# EAGLE design Auto Temp Sensor Second Way (EAGLE 9.6.2)
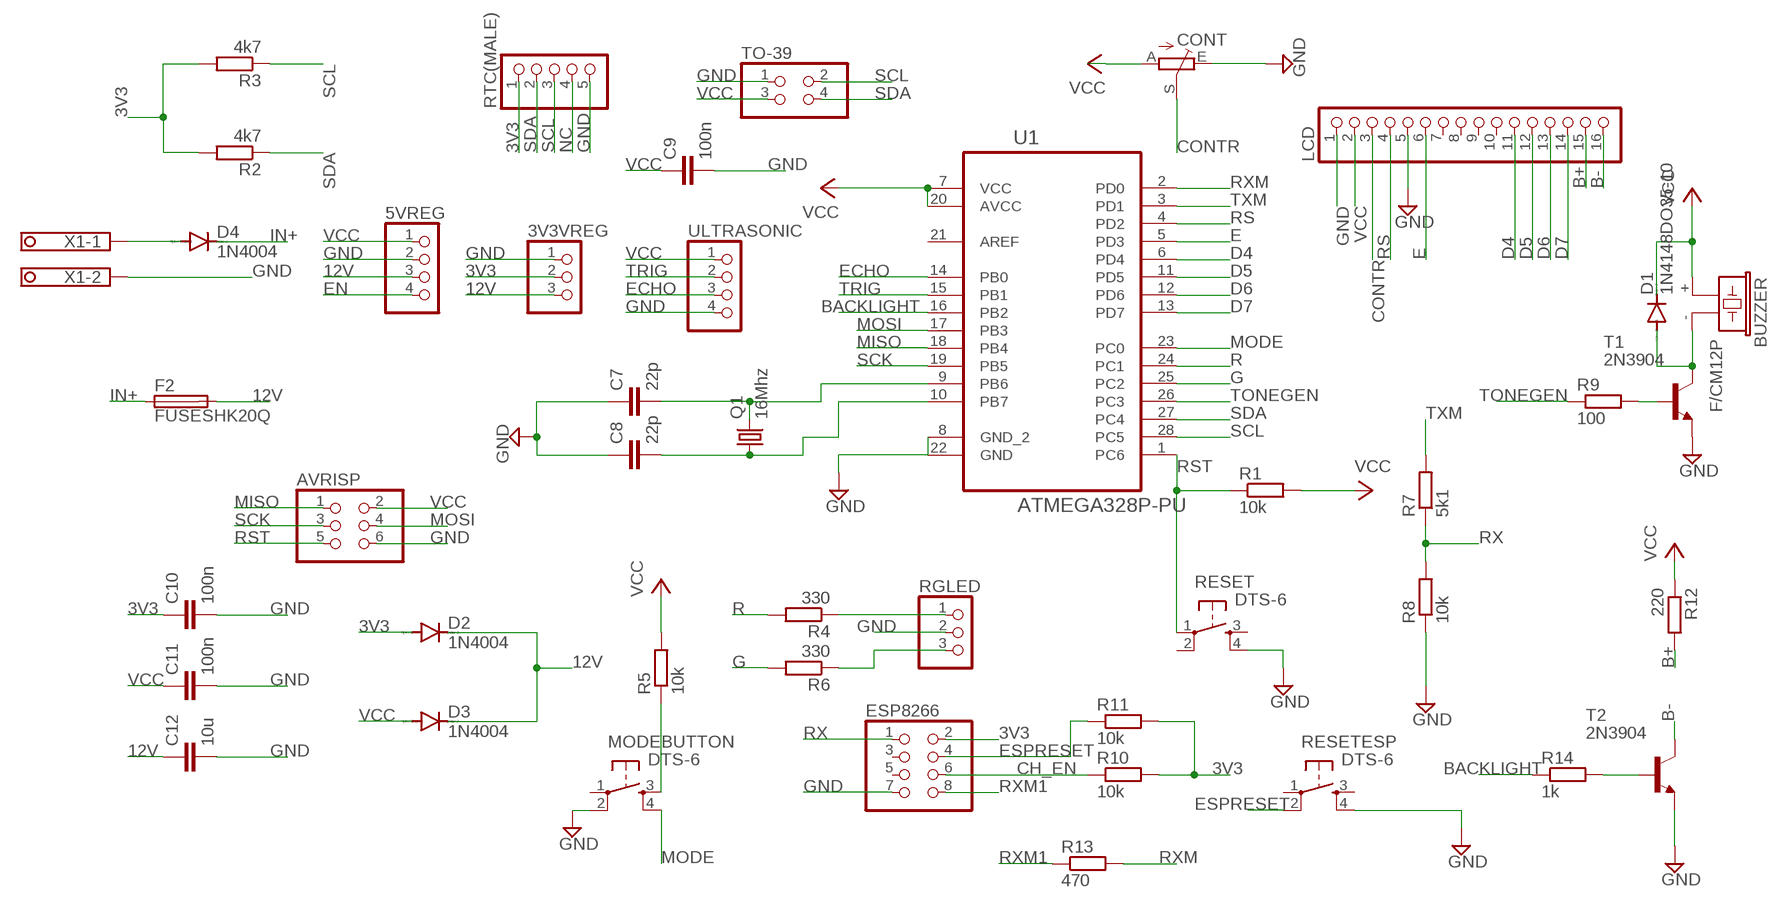
[diagram p0: schematic, sheet 1]

## Parts
3V3VREG  PINHD-1X3M  [1X03M]
5VREG  PINHD-1X4M  [1X04M]
AVRISP  PINHD-2X3  [2X03]
BUZZER  F/CM12P  [F/CM12P]
C7  22p  C-EU050-024X044  [C050-024X044]
C8  22p  C-EU050-024X044  [C050-024X044]
C9  100n  C-EU050-024X044  [C050-024X044]
C10  100n  C-EU050-024X044  [C050-024X044]
C11  100n  C-EU050-024X044  [C050-024X044]
C12  10u  C-EU050-024X044  [C050-024X044]
CONT  10k  TRIM_EU-B25P  [B25P]
D1  1N4148DO35-10  [DO35-10]
D2  1N4004  [DO41-10]
D3  1N4004  [DO41-10]
D4  1N4004  [DO41-10]
ESP8266  PINHD-2X4  [2X04]
F2  FUSESHK20Q  [SHK20Q]
LCD  PINHD-1X16  [1X16]
MODEBUTTON  DTS-6  [DTS-6]
Q1  16Mhz  CRYSTALHC49S  [HC49/S]
R1  10k  R-EU_0207/10  [0207/10]
R2  4k7  R-EU_0207/10  [0207/10]
R3  4k7  R-EU_0207/10  [0207/10]
R4  330  R-EU_0207/10  [0207/10]
R5  10k  R-EU_0207/10  [0207/10]
R6  330  R-EU_0207/10  [0207/10]
R7  5k1  R-EU_0207/10  [0207/10]
R8  10k  R-EU_0207/10  [0207/10]
R9  100  R-EU_0207/10  [0207/10]
R10  10k  R-EU_0207/10  [0207/10]
R11  10k  R-EU_0207/10  [0207/10]
R12  220  R-EU_0207/10  [0207/10]
R13  470  R-EU_0207/10  [0207/10]
R14  1k  R-EU_0207/10  [0207/10]
RESET  DTS-6  [DTS-6]
RESETESP  DTS-6  [DTS-6]
RGLED  PINHD-1X3M  [1X03M]
RTC(MALE)  PINHD-1X5  [1X05]
T1  2N3904  [TO92]
T2  2N3904  [TO92]
TO-39  PINHD-2X2  [2X02]
U1  ATMEGA328P-PU  [DIP254P762X457-28]
ULTRASONIC  PINHD-1X4  [1X04]
X1  TERMINAL-BLOCK-3.5MM-2-PIN-LONG-PAD  [TERMINAL-BLOCK-2-PIN-3.5MM-LONG-PAD]

## Nets
3V3: 3V3VREG.2 C10.1 D2.A ESP8266.2 R2.2 R3.2 R10.2 R11.2 RTC(MALE).1
12V: 3V3VREG.3 5VREG.3 C12.1 D2.C D3.C F2.2A
B+: LCD.15 R12.2
B-: LCD.16 T2.1(C)
BACKLIGHT: R14.1 U1.16(PB2)
CH_EN: ESP8266.6 R10.1
CONTR: CONT.S LCD.3
D4: LCD.11 U1.6(PD4)
D5: LCD.12 U1.11(PD5)
D6: LCD.13 U1.12(PD6)
D7: LCD.14 U1.13(PD7)
E: LCD.6 U1.5(PD3)
ECHO: U1.14(PB0) ULTRASONIC.3
EN: 5VREG.4
ESPRESET: ESP8266.4 R11.1 RESETESP.2
G: R6.2 U1.25(PC2)
GND: 3V3VREG.1 5VREG.2 AVRISP.6 C7.1 C8.1 C9.2 C10.2 C11.2 C12.2 CONT.E ESP8266.7 LCD.1 LCD.5 MODEBUTTON.2 R8.1 RESET.4 RESETESP.4 RGLED.2 RTC(MALE).5 T1.3(E) T2.3(E) TO-39.1 U1.8(GND_2) U1.22(GND) ULTRASONIC.4 X1.2
IN+: D4.C F2.1A
MISO: AVRISP.1 U1.18(PB4)
MODE: MODEBUTTON.4 U1.23(PC0)
MOSI: AVRISP.4 U1.17(PB3)
N$1: R14.2 T2.2(B)
N$2: C8.2 Q1.1 U1.10(PB7)
N$3: C7.2 Q1.2 U1.9(PB6)
N$5: D4.A X1.1
N$7: R4.1 RGLED.1
N$8: R6.1 RGLED.3
N$9: MODEBUTTON.3 R5.1
N$13: BUZZER.- D1.A T1.1(C)
N$14: R9.2 T1.2(B)
NC: RTC(MALE).4
R: R4.2 U1.24(PC1)
RS: LCD.4 U1.4(PD2)
RST: AVRISP.5 R1.1 RESET.1 U1.1(PC6)
RX: ESP8266.1 R7.1 R8.2
RXM: R13.2 U1.2(PD0)
RXM1: ESP8266.8 R13.1
SCK: AVRISP.3 U1.19(PB5)
SCL: R3.1 RTC(MALE).3 TO-39.2 U1.28(PC5)
SDA: R2.1 RTC(MALE).2 TO-39.4 U1.27(PC4)
TONEGEN: R9.1 U1.26(PC3)
TRIG: U1.15(PB1) ULTRASONIC.2
TXM: R7.2 U1.3(PD1)
VCC: 5VREG.1 AVRISP.2 BUZZER.+ C9.1 C11.1 CONT.A D1.C D3.A LCD.2 R1.2 R5.2 R12.1 TO-39.3 U1.7(VCC) U1.20(AVCC) ULTRASONIC.1
Unconnected: ESP8266.3 ESP8266.5 LCD.7 LCD.8 LCD.9 LCD.10 MODEBUTTON.1 RESET.2 RESET.3 RESETESP.1 RESETESP.3 U1.21(AREF)

## Library data of the parts
3V3VREG RGLED = pinhead_2:PINHD-1X3: PIN HEADER
5VREG ULTRASONIC = pinhead_2:PINHD-1X4: PIN HEADER
AVRISP = pinhead_2:PINHD-2X3: PIN HEADER
BUZZER = buzzer:F/CM12P: BUZZER Source: Buerklin; OC_FARNELL: unknown; OC_NEWARK: unknown
C7-C12 = rcl:C-EU: CAPACITOR, European symbol; SPICEPREFIX: C
CONT = pot:TRIM_EU-: POTENTIOMETER
D1 = diode:1N4148: DIODE high speed (Philips)
D2-D4 = diode:1N4004: DIODE general purpose rectifier, 1 A
ESP8266 = pinhead_2:PINHD-2X4: PIN HEADER
F2 = fuse:FUSE: Fuse; OC_FARNELL: unknown; OC_NEWARK: unknown
LCD = pinhead_2:PINHD-1X16: PIN HEADER
MODEBUTTON RESET RESETESP = switch-tact:DTS-6
Q1 = crystal:CRYSTAL: CRYSTAL; OC_FARNELL: 1667008; OC_NEWARK: unknown
R1-R14 = rcl:R-EU_: RESISTOR, European symbol; SPICEPREFIX: R
RTC(MALE) = pinhead:PINHD-1X5: PIN HEADER
T1 T2 = transistor:2N3904: NPN TRANSISTOR
TO-39 = pinhead_2:PINHD-2X2: PIN HEADER
U1 = ATMEGA328P-PU:ATMEGA328P-PU: 8-bit Microcontroller with In-System Programmable Flash Buy Part <https://snapeda.com/parts/ATMEGA328P-PU/Microchip/view-part/?ref=eda>; AVAILABILITY: Good; DESCRIPTION: AVR AVR® ATmega Microcontroller IC 8-Bit 20MHz 32KB (16K x 16) FLASH 28-PDIP; DIGIKEY-PURCHASE-URL: https://snapeda.com/shop?store=DigiKey&id=2895131; MF: Microchip; MOUSER-PURCHASE-URL: https://snapeda.com/shop?store=Mouser&id=2895131; MP: ATMEGA328P-PU; PACKAGE: DIP-28 Generic; PRICE: None
X1 = Rembrandt Electronics - Terminal Block 3-5mm v1-0:TERMINAL-BLOCK-3.5MM-2-PIN: Terminal Block 3.5mm Pitch: 3,5 mm Number of pins: 2 Created by Rembrandt Electronics www.rembrandtelectronics.com

## Board
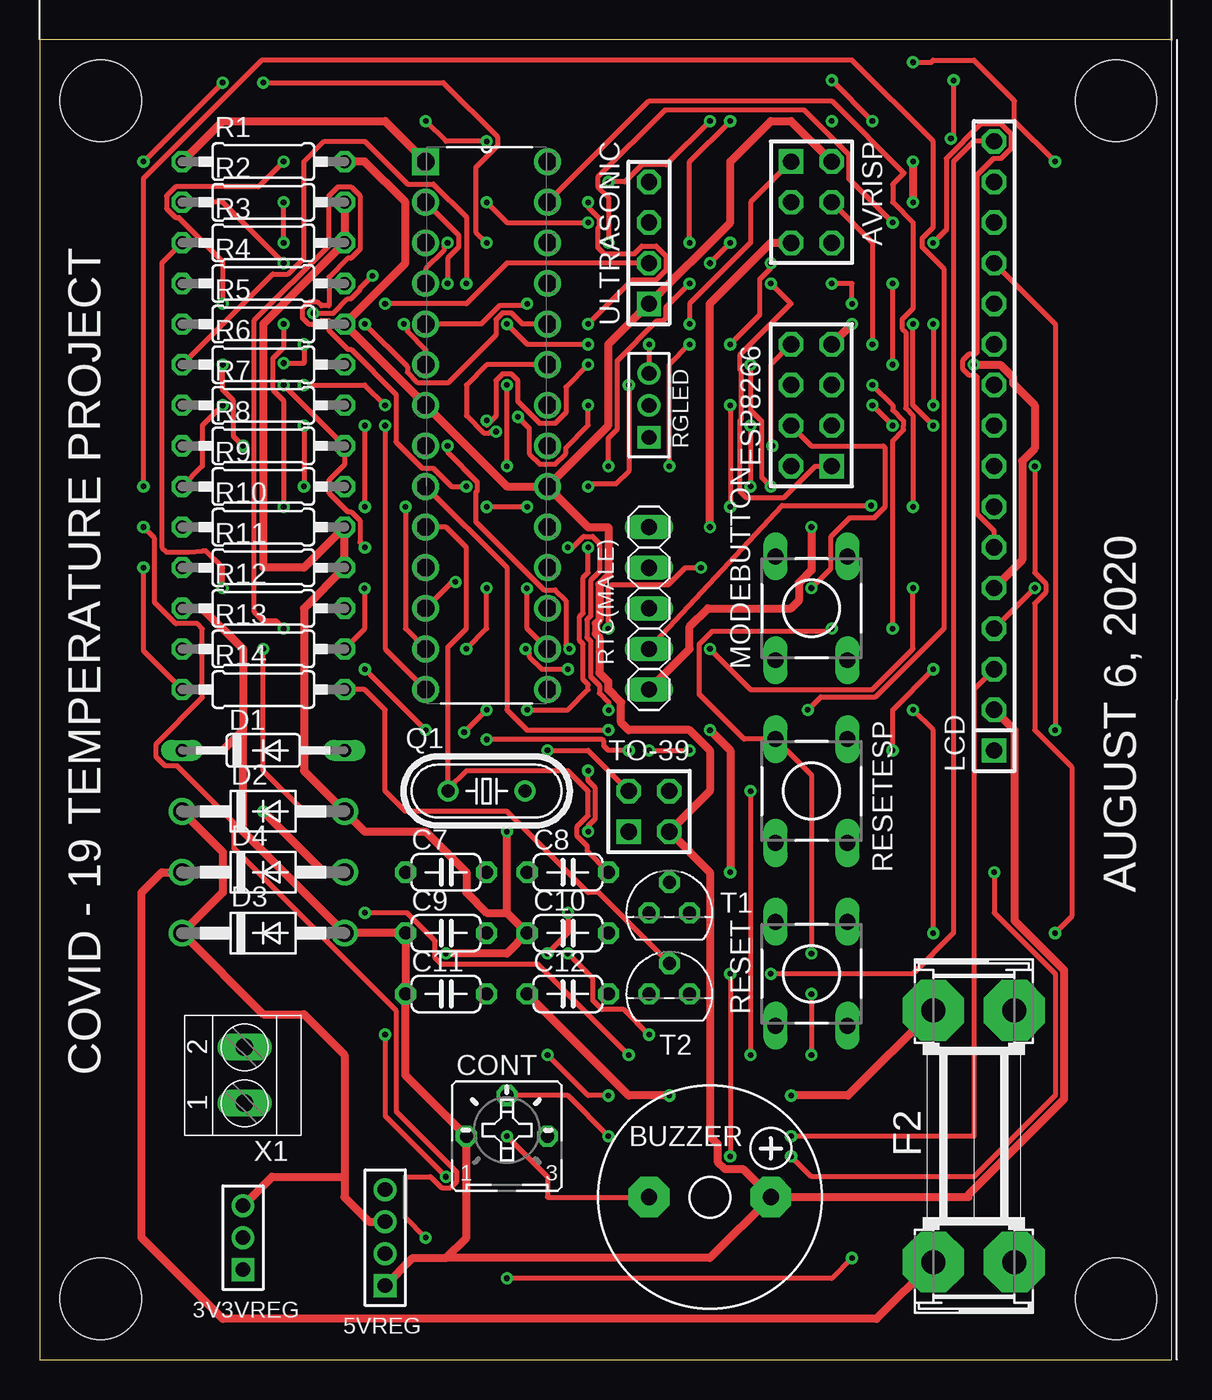
[diagram p1: board, top side]
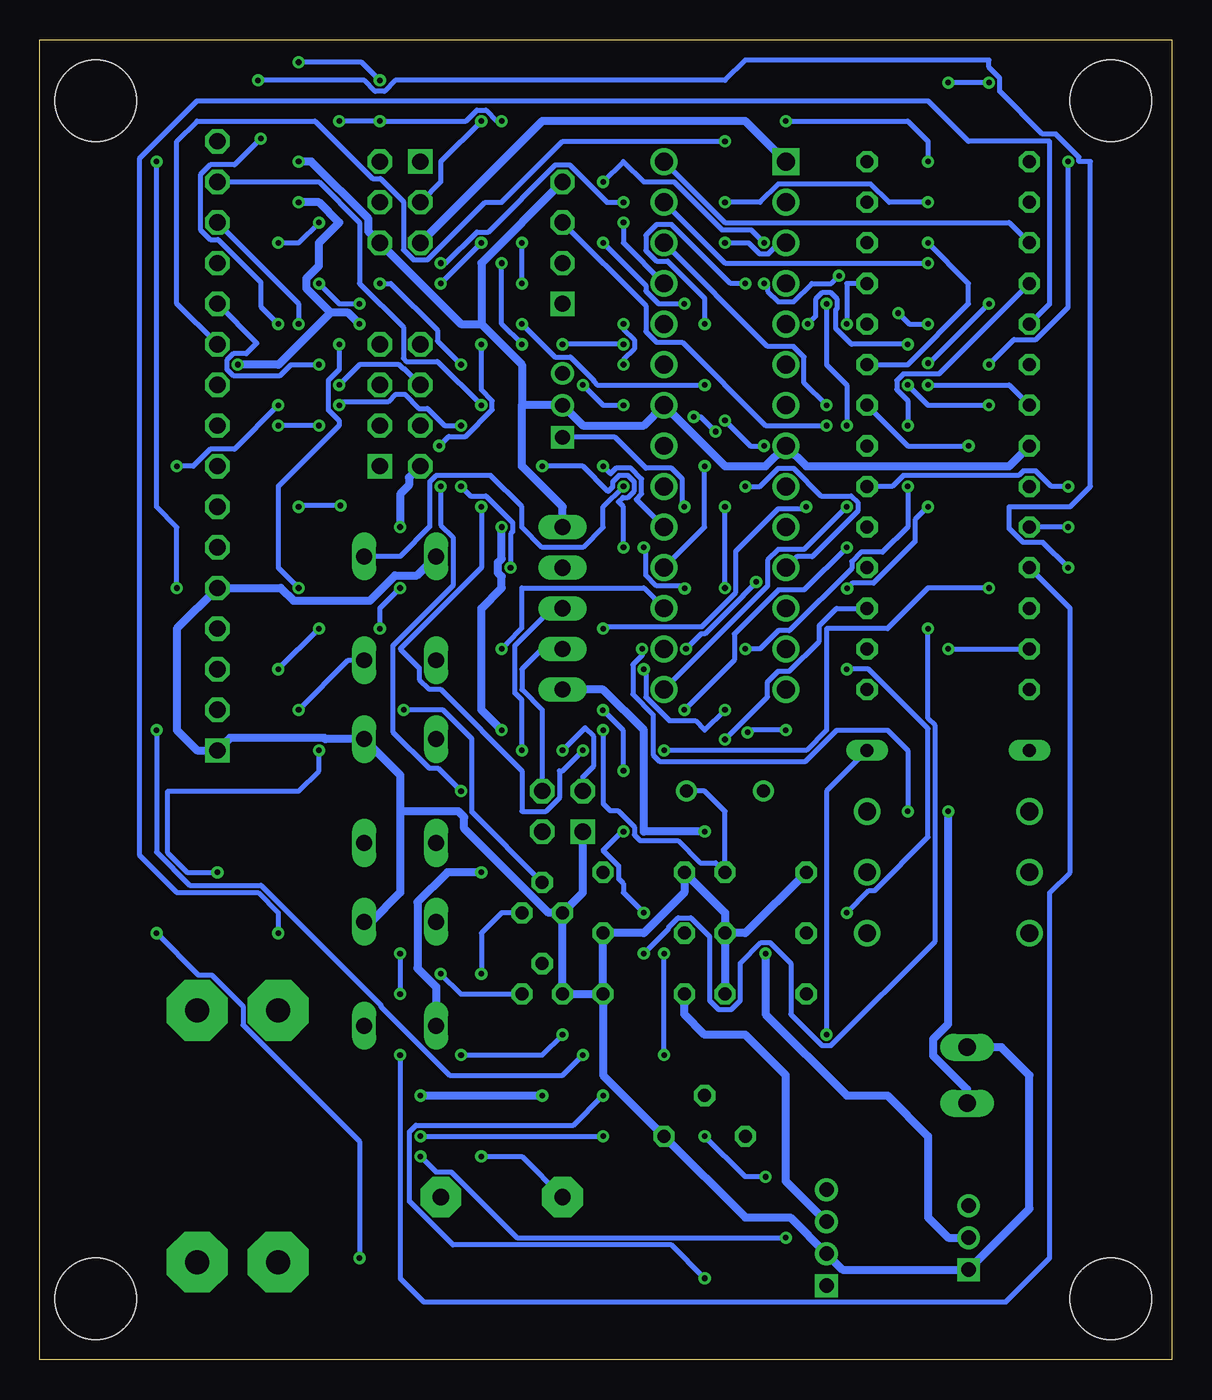
[diagram p2: board, bottom side, seen from below]

Size 70.79 x 82.54 mm. Coordinates in mm from the lower left corner, seen from the top.
Outline: 0,0 70.79,0 70.79,82.54 0,82.54 0,0
Copper layers (1*16): Top 0.035mm / dielectric 1.5mm / Bottom 0.035mm
Design rules "default": minimum track width 6mil, minimum drill 0.35mm, track to track 6mil, track to pad 6mil, pad to pad 6mil, via to via 6mil, smd to smd 6mil, copper to edge 40mil, drill to drill 6mil, minimum pad ring 10mil, minimum via ring 8mil, stop-mask expansion 4mil, vias tented up to drill 0mil, thermal gap 10mil
Holes 5.08 mm at 3.81,3.81 67.31,78.74 3.81,78.74 67.31,3.81

### Footprints (pad centres in the part's own frame; a part is rotated, then mirrored left to right if it is on the bottom)
1X03M = drill 0.914 square: 1 -2,0 | drill 0.914: 2 0,0; 3 2,0
1X04M = drill 0.914 square: 1 -3,0 | drill 0.914: 2 -1,0; 3 1,0; 4 3,0
2X03 = drill 1.016 square: 1 -2.54,-1.27 | drill 1.016 octagon: 2 -2.54,1.27; 3 0,-1.27; 4 0,1.27; 5 2.54,-1.27; 6 2.54,1.27
F/CM12P = drill 1.016 pad 2.54 octagon: + 3.81,0; - -3.81,0
C050-024X044 = drill 0.813 octagon: 1 -2.54,0; 2 2.54,0
B25P = drill 0.813 octagon: A -2.54,0; E 2.54,0; S 0,2.54
DO35-10 = drill 0.813 long: A 5.08,0; C -5.08,0
DO41-10 = drill 1.118: A 5.08,0; C -5.08,0
2X04 = drill 1.016 square: 1 -3.81,-1.27 | drill 1.016 octagon: 2 -3.81,1.27; 3 -1.27,-1.27; 4 -1.27,1.27; 5 1.27,-1.27; 6 1.27,1.27; 7 3.81,-1.27; 8 3.81,1.27
SHK20Q = drill 1.5 pad 3.81 octagon: 1A -7.874,2.54; 1B -7.874,-2.54; 2A 7.874,2.54; 2B 7.874,-2.54
1X16 = drill 1.016 square: 1 -19.05,0 | drill 1.016 octagon: 2 -16.51,0; 3 -13.97,0; 4 -11.43,0; 5 -8.89,0; 6 -6.35,0; 7 -3.81,0; 8 -1.27,0; 9 1.27,0; 10 3.81,0; 11 6.35,0; 12 8.89,0; 13 11.43,0; 14 13.97,0; 15 16.51,0; 16 19.05,0
DTS-6 = drill 1 long: 1 -3.25,2.25; 2 3.25,2.25; 3 -3.25,-2.25; 4 3.25,-2.25
HC49/S = drill 0.813: 1 -2.413,0; 2 2.413,0
0207/10 = drill 0.813 octagon: 1 -5.08,0; 2 5.08,0
1X05 = drill 1.016 long: 1 -5.08,0; 2 -2.54,0; 3 0,0; 4 2.54,0; 5 5.08,0
TO92 = drill 0.813 octagon: 1 1.27,0; 2 0,1.905; 3 -1.27,0
2X02 = drill 1.016 square: 1 -1.27,-1.27 | drill 1.016 octagon: 2 -1.27,1.27; 3 1.27,-1.27; 4 1.27,1.27
DIP254P762X457-28 = drill 1.118 square: 1 -7.62,33.02 | drill 1.118: 2 -7.62,30.48; 3 -7.62,27.94; 4 -7.62,25.4; 5 -7.62,22.86; 6 -7.62,20.32; 7 -7.62,17.78; 8 -7.62,15.24; 9 -7.62,12.7; 10 -7.62,10.16; 11 -7.62,7.62; 12 -7.62,5.08; 13 -7.62,2.54; 14 -7.62,0; 15 0,0; 16 0,2.54; 17 0,5.08; 18 0,7.62; 19 0,10.16; 20 0,12.7; 21 0,15.24; 22 0,17.78; 23 0,20.32; 24 0,22.86; 25 0,25.4; 26 0,27.94; 27 0,30.48; 28 0,33.02
1X04 = drill 1.016 square: 1 -3.81,0 | drill 1.016 octagon: 2 -1.27,0; 3 1.27,0; 4 3.81,0
TERMINAL-BLOCK-2-PIN-3.5MM-LONG-PAD = drill 1.1 pad 1.7 long: 1 -1.75,-0.1; 2 1.75,-0.1

### Placement (x,y rotation side)
3V3VREG  12.7,7.62 90 top
5VREG  21.59,7.62 90 top
AVRISP  48.26,72.39 270 top
BUZZER  41.91,10.16 0 top
C7  25.4,30.48 0 top
C8  33.02,30.48 0 top
C9  25.4,26.67 0 top
C10  33.02,26.67 0 top
C11  25.4,22.86 0 top
C12  33.02,22.86 0 top
CONT  29.21,13.97 0 top
D1  13.97,38.1 0 top
D2  13.97,34.29 0 top
D3  13.97,26.67 0 top
D4  13.97,30.48 0 top
ESP8266  48.26,59.69 90 top
F2  58.42,13.97 90 top
LCD  59.69,57.15 90 top
MODEBUTTON  48.26,46.99 90 top
Q1  27.94,35.56 0 top
R1  13.97,74.93 0 top
R2  13.97,72.39 0 top
R3  13.97,69.85 0 top
R4  13.97,67.31 0 top
R5  13.97,64.77 0 top
R6  13.97,62.23 0 top
R7  13.97,59.69 0 top
R8  13.97,57.15 0 top
R9  13.97,54.61 0 top
R10  13.97,52.07 0 top
R11  13.97,49.53 0 top
R12  13.97,46.99 0 top
R13  13.97,44.45 0 top
R14  13.97,41.91 0 top
RESET  48.26,24.13 90 top
RESETESP  48.26,35.56 90 top
RGLED  38.1,59.69 90 top
RTC(MALE)  38.1,46.99 90 top
T1  39.37,27.94 0 top
T2  39.37,22.86 0 top
TO-39  38.1,34.29 0 top
U1  31.75,41.91 0 top
ULTRASONIC  38.1,69.85 90 top
X1  12.7,17.78 90 top

### Tracks (layer width: path | path; a pad name or v marks a point on that pad's centre or on a via)
3V3  (via drill 0.35)
  Top 0.508: 29.21,27.94 27.94,27.94 26.67,29.21 26.67,30.48 24.13,33.02 20.32,33.02 D2.A 16.51,36.83 16.51,46.99 R11.2 R10.2 16.51,49.53 13.97,49.53 13.97,64.77 R3.2 R2.2 | 29.21,27.94 C10.1 29.21,25.4 v25.4,25.4 | 29.21,27.94 v29.21,33.02 | v48.26,52.07 48.26,49.37 47.48,48.59 47.48,47.48 46.99,46.99 41.78,46.99 40.64,45.85 40.64,44.45 RTC(MALE).1
  Bottom 0.508: v25.4,25.4 25.4,21.59 20.32,16.51 17.78,16.51 15.24,13.97 15.24,8.89 13.97,7.62 3V3VREG.2 | v29.21,33.02 33.02,33.02 33.02,39.37 35.56,41.91 RTC(MALE).1 | ESP8266.2 47.7,55.17 47.7,54.68 48.26,54.12 v48.26,52.07
12V  (via drill 0.35)
  Top 0.508: 19.05,11.43 19.05,19.05 16.51,21.59 13.97,21.59 D3.C 11.43,29.21 11.43,31.75 D2.C | 19.05,11.43 19.05,10.16 20.59,8.62 5VREG.3 | 3V3VREG.3 14.51,11.43 19.05,11.43 | F2.2A 50.55,16.51 v46.99,16.51 | v39.37,16.51 36.83,16.51 C12.1
  Bottom 0.508: v46.99,16.51 v39.37,16.51 | 5VREG.3 24.13,11.16 24.13,17.78 26.67,20.32 29.21,20.32 30.48,21.59 C12.1
B+  (via drill 0.35)
  Top 0.305: v43.18,59.69 v43.18,53.34 | v27.94,38.78 35.18,38.78 35.28,38.69 35.28,38.38 35.56,38.1 v36.83,38.1
  Bottom 0.305: LCD.15 53.34,73.66 50.8,71.12 50.8,67.31 48.06,64.57 48.06,62.61 47.88,62.43 45.92,62.43 v43.18,59.69 | v43.18,53.34 43.18,49.53 48.26,44.45 47.07,43.26 47.07,42.55 46.45,41.93 45.74,41.93 40.64,36.83 40.64,34.29 39.13,34.29 38.3,35.12 38.3,36.83 38.1,36.83 v36.83,38.1 | v27.94,38.78 25.27,41.45 25.27,42.38 24.6,43.05 23.91,43.05 22.05,44.92 22.05,45.91 20.97,46.99 R12.2
B-  (via drill 0.35)
  Top 0.305: LCD.16 58.42,76.2 57.15,74.93 57.15,26.67 54.61,24.13 v45.72,24.13
  Bottom 0.305: v45.72,24.13 44.45,22.86 T2.1
BACKLIGHT  (via drill 0.35)
  Top 0.305: R14.1 6.47,44.33 v6.47,49.53 | U1.16 30.48,45.72 30.48,48.26 v30.46,48.24 | v55.88,64.77 v55.88,59.69 | v63.5,26.67 64.54,27.71 64.54,37.06 62.23,39.37 62.23,47.29 62.91,47.98 62.91,48.54 62.23,49.23 v62.23,55.88 | v50.8,6.35 49.53,5.08 v29.21,5.08 | v35.56,16.51 34.29,16.51 v31.75,19.05 | v31.75,25.4 33.02,26.67 v33.02,27.94 | v34.29,36.83 34.29,36.21 34.75,35.75 34.75,33.83 34.29,33.38 v34.29,33.02 | v35.58,40.62 35.58,41.1 35,41.68 35,42.16 34.44,42.72 34.44,44.94 34.22,45.16 34.22,46.28 34.44,46.5 34.44,48.72 35,49.28 35,51.05 34.57,51.48 34.01,51.48 33.32,50.8 v33.02,50.8 | v57.15,80.01 57.15,76.54 v56.98,76.37
  Bottom 0.305: v6.47,49.53 8.05,51.1 9.29,51.1 10.16,51.98 10.16,53.34 6.35,53.34 5.08,54.61 5.08,74.93 5.79,74.93 5.79,75.21 7.23,76.66 8.08,76.66 10.75,79.33 10.75,80.16 11.43,80.84 11.43,81.28 26.67,81.28 27.94,80.01 48.56,80.01 49.25,79.33 49.81,79.33 50.5,80.01 v57.15,80.01 | v55.88,64.77 56.98,65.87 56.98,67.38 59.66,70.05 60.13,70.05 60.76,70.68 60.76,74.1 60.13,74.73 58.62,74.73 v56.98,76.37 | v55.88,59.69 58.62,56.95 60.13,56.95 61.2,55.88 v62.23,55.88 | v63.5,26.67 60.88,24.05 60.05,24.05 58.09,22.1 58.09,20.93 50.8,13.64 v50.8,6.35 | v29.21,5.08 31.29,7.16 44.95,7.16 47.67,9.89 47.67,14.25 47.27,14.65 37.42,14.65 v35.56,16.51 | v31.75,19.05 v31.75,25.4 | v34.29,36.83 34.29,39.34 v35.58,40.62 | v30.46,48.24 30.61,48.39 32.22,48.39 32.89,49.06 32.89,50.67 v33.02,50.8 | v34.29,33.02 34.38,33.02 35.56,31.84 34.59,30.88 34.59,30.08 34.29,29.77 34.29,29.21 v33.02,27.94
CH_EN  (via drill 0.35)
  Top 0.305: v59.69,30.48 59.69,27.94 63.5,24.13 63.5,16.51 58.42,11.43 48.26,11.43 v46.99,12.7 | v24.13,7.62 22.86,8.89 22.86,11.43 24.43,11.43 25.12,10.75 25.68,10.75 26.08,11.15 26.08,11.71 22.3,15.49 22.3,21.8 12.14,31.96 12.14,33.58 8.59,37.13 7.83,37.13 7.26,37.7 7.26,38.5 10.16,41.4 10.16,45.72 9.86,46.02 8.49,46.02 7.16,47.35 7.16,51.38 v6.47,52.07 | v53.34,38.1 53.34,40.64 v55.88,43.18 | v52.07,60.96 53.34,59.69 53.34,59.39 54.02,58.7 54.02,58.42 54.02,58.14 53.34,57.45 v53.34,45.72
  Bottom 0.305: v59.69,30.48 61.58,30.48 62.79,31.68 62.79,35.56 54.61,35.56 53.34,36.83 v53.34,38.1 | v46.99,12.7 46.02,11.73 45.07,11.73 40.95,7.62 v24.13,7.62 | v6.47,52.07 R10.1 | ESP8266.6 48.01,61.98 48.07,61.98 48.32,62.23 50.8,62.23 v52.07,60.96 | v55.88,43.18 v53.34,45.72
CONTR  (via drill 0.35)
  Top 0.305: LCD.3 58.42,41.91 58.42,13.97 v46.99,13.97 | v35.56,13.97 33.02,16.51 CONT.S
  Bottom 0.305: v46.99,13.97 v35.56,13.97
D4  (via drill 0.35)
  Top 0.305: v27.94,76.2 25.4,76.2 v24.13,77.47 | v15.24,74.93 13.67,73.36 8.49,73.36 7.93,72.79 7.93,71.99 8.49,71.42 8.68,71.42 11.43,68.67 v11.43,66.04 | v15.24,62.33 16.51,62.33 v16.51,63.5 | v22.76,64.77 22.99,64.54 22.99,64.3 24.13,63.15 U1.6
  Bottom 0.305: LCD.11 62.23,66.04 62.23,76.2 60.96,77.47 53.58,77.47 49.97,73.86 49.49,73.86 48.06,72.42 48.06,69.41 47.43,68.78 46.55,68.78 42.94,72.39 41.91,72.39 38.1,76.2 v27.94,76.2 | v24.13,77.47 16.51,77.47 15.24,76.2 v15.24,74.93 | v11.43,66.04 15.14,62.33 v15.24,62.33 | v22.76,64.77 22.27,65.26 22.27,66.32 21.87,66.72 21.31,66.72 20.91,66.32 20.91,65.76 21,65.66 21,64.49 20.02,63.5 v16.51,63.5
D5  (via drill 0.35)
  Top 0.305: v53.34,62.23 v53.34,67.31 | v50.8,66.04 50.8,67.31 v49.53,67.31 | v44.45,62.23 44.45,59.39 45.13,58.7 45.13,55.2 v45.72,54.61 | v44.45,35.56 v44.45,19.05 | v38.1,20.32 36.52,21.89 35.16,21.89 34.59,22.46 34.59,23.82 v33.02,25.4 | v26.67,54.61 25.75,54.61 24.6,55.75 23.91,55.75 22.27,57.39 22.27,60.37 19.45,63.2 19.26,63.2 18.09,64.37 18.09,65 17.61,65 17.38,64.77 16.81,64.77 16.41,65.17 16.41,65.73 16.81,66.14 17.38,66.14 17.61,65.91 18.09,65.91 18.09,67.71 19.26,68.89 19.45,68.89 20.02,69.45 20.02,72.79 19.45,73.36 18.65,73.36 18.09,72.79 18.09,69.67 13.41,65 13.41,46.76 13.97,46.2 14.76,46.2 v15.24,45.72
  Bottom 0.305: v53.34,67.31 52.07,66.04 v50.8,66.04 | v49.53,67.31 48.84,67.31 45.92,64.39 45.92,63.7 v44.45,62.23 | v45.72,54.61 45.72,52.2 44.95,51.43 44.95,48.41 48.72,44.64 48.72,39.27 46.45,37 45.89,37 v44.45,35.56 | v44.45,19.05 39.37,19.05 v38.1,20.32 | v33.02,25.4 31.45,26.98 31.45,27.07 30.88,27.64 30.08,27.64 28.91,26.46 28.91,22.46 28.34,21.89 27.54,21.89 26.98,22.46 26.98,24.79 25.68,26.08 25.12,26.08 23.83,24.79 23.83,21.59 21.87,19.64 21.31,19.64 14.78,26.16 14.78,39.65 15.24,40.11 v15.24,45.72 | U1.11 23.44,50.22 22.48,50.22 19.64,53.06 19.64,53.62 20.04,54.02 21.93,54.02 23.66,55.75 24.6,55.75 25.75,54.61 v26.67,54.61 | v53.34,62.23 55.08,62.23 55.77,61.55 58.7,61.55 59.1,61.95 59.1,62.51 58.7,62.91 57.89,62.91 57.23,63.58 LCD.12
D6  (via drill 0.35)
  Top 0.305: LCD.13 63.5,64.77 v63.5,39.37 | v36.83,19.05 31.16,24.72 25.12,24.72 24.72,25.12 24.72,26.18 22.95,27.94 v20.32,27.94 | v20.32,43.18 v24.13,39.37 | v30.38,44.45 30.61,44.22 30.61,43.98 31.4,43.18 v33.02,43.18 | v27.94,40.64 v26.53,39.23 | v25.99,48.64 25.78,48.64 U1.12
  Bottom 0.305: v63.5,39.37 63.5,31.75 61.42,29.67 56.96,29.67 49.45,22.16 49.45,22.07 45.16,17.78 38.1,17.78 v36.83,19.05 | v20.32,27.94 18.92,29.34 18.58,29.34 15.24,32.67 15.24,39.47 18.95,43.18 v20.32,43.18 | v24.13,39.37 26.39,39.37 v26.53,39.23 | v30.38,44.45 29.44,45.39 29.2,45.39 26.8,47.79 26.8,47.83 v25.99,48.64 | v33.02,43.18 32.89,43.05 32.89,41.44 31.41,39.96 29.8,39.96 29.21,39.37 v27.94,40.64
D7  (via drill 0.35)
  Top 0.305: v44.45,58.42 v44.45,54.61 | v22.86,53.34 22.86,45.72 U1.13 | v52.07,59.69 v53.34,58.42 | v55.88,58.42 54.61,59.69 v54.61,64.77 | v35.56,45.72 35.56,48.26 35.76,48.46 39.3,48.46 40.37,49.53 v41.35,49.53
  Bottom 0.305: LCD.14 54.61,66.04 v54.61,64.77 | v44.45,58.42 45.48,58.42 46.55,59.49 47.09,59.49 47.98,60.37 48.54,60.37 49.02,59.89 51.87,59.89 v52.07,59.69 | v41.35,49.53 41.35,51.66 41.23,51.79 41.23,52.35 42.9,54.02 43.86,54.02 v44.45,54.61 | v22.86,53.34 22.99,53.21 24.6,53.21 27.26,50.56 27.26,47.98 29.39,45.85 35.43,45.85 v35.56,45.72 | v53.34,58.42 v55.88,58.42
E  (via drill 0.35)
  Top 0.305: LCD.6 59.69,51.83 58.62,52.9 58.62,61.47 58.54,61.55 58.14,61.55 57.74,61.95 57.74,62.51 58.14,62.91 58.54,62.91 58.62,62.99 58.62,74.1 59.66,75.13 60.13,75.13 60.76,75.76 60.76,76.64 60.13,77.27 58.84,77.27 56.69,75.12 56.69,70.66 v55.88,69.85 | v35.56,69.85 35.56,72.69 34.88,73.38 34.88,73.94 39.09,78.15 47.82,78.15 50.6,75.37 50.6,73.86 v53.34,71.12 | v30.48,66.04 30.35,65.91 28.74,65.91 27.6,64.77 U1.5
  Bottom 0.305: v55.88,69.85 54.61,69.85 v53.34,71.12 | v35.56,69.85 32.89,67.18 32.89,66.84 32.1,66.04 v30.48,66.04
ECHO  (via drill 0.35)
  Top 0.305: v21.59,58.42 21.59,44.45 U1.14
  Bottom 0.305: v21.59,58.42 25.4,58.42 30.61,63.63 32.22,63.63 32.89,64.3 32.89,65.91 ULTRASONIC.3
ESPRESET  (via drill 0.35)
  Top 0.305: v48.26,48.26 49.45,49.45 49.45,51.43 50.68,52.66 52.2,52.66 52.88,53.34 52.88,57.02 52.75,57.15 48.26,57.15 ESP8266.4 | v49.53,45.72 49.36,45.55 42.05,45.55 41.23,44.73 41.23,41.63 44.04,38.81 RESETESP.2 48.26,36.56 v48.26,25.4 | v48.26,22.86 v48.26,19.05
  Bottom 0.305: v48.26,48.26 49.53,46.99 v49.53,45.72 | v48.26,25.4 v48.26,22.86 | v48.26,19.05 48.26,5.08 46.78,3.6 10.37,3.6 7.62,6.35 7.62,29.21 6.35,30.48 6.35,46.99 R11.1
G  (via drill 0.35)
  Top 0.305: v15.24,69.85 v15.24,72.39 | v27.94,72.39 29.21,71.12 v34.29,71.12
  Bottom 0.305: R6.2 16.51,62.23 12.7,66.04 12.7,67.31 v15.24,69.85 | v15.24,72.39 17.69,72.39 18.83,73.53 24.6,73.53 25.75,72.39 v27.94,72.39 | v34.29,71.12 34.29,69.85 U1.25
GND  (via drill 0.35)
  Top 0.508: LCD.5 61.45,50.02 61.45,56.2 62.23,56.99 62.23,59.69 60.86,61.06 60.86,61.44 60.07,62.23 v58.42,62.23 | ESP8266.7 v50.8,64.77 | v54.61,74.93 v54.61,72.39
  Bottom 0.508: R8.1 10.16,55.88 22.86,55.88 U1.8 25.4,55.88 27.94,55.88 U1.22 33.02,58.42 36.83,58.42 RGLED.2 40.64,59.69 | C12.2 35.56,17.78 CONT.E 26.67,8.89 23.86,8.89 5VREG.2 20.59,5.62 3V3VREG.1 8.89,9.43 8.89,17.78 10.64,19.53 X1.2 | C12.2 T2.3 T1.3 | C12.2 C10.2 33.02,26.67 30.48,29.21 C8.1 27.94,27.94 C9.2 | C7.1 26.67,26.67 C9.2 | T1.3 36.83,29.21 TO-39.1 | 48.26,34.29 48.26,36.56 RESETESP.4 52.94,38.81 53.02,38.88 58.91,38.88 LCD.1 60.96,38.1 62.23,39.37 62.23,45.72 LCD.5 55.72,48.26 54.93,47.48 50.15,47.48 48.59,49.05 47.2,49.05 MODEBUTTON.2 | 48.26,34.29 48.26,29.21 50.09,27.38 RESET.4 | 43.18,64.77 44.45,64.77 AVRISP.6 50.24,70.56 50.24,71.35 53.82,74.93 v54.61,74.93 | 43.18,64.77 40.64,62.23 40.64,59.69 | ULTRASONIC.4 43.18,68.58 43.18,64.77 | C9.2 C11.2 | 40.64,59.69 40.64,55.88 38.1,53.34 RTC(MALE).5 | T1.3 38.97,27.94 44.25,33.21 44.25,33.93 44.61,34.29 48.26,34.29 | v50.8,64.77 51.51,65.48 52.62,65.48 | 52.62,65.48 54.12,66.98 54.12,67.64 53.34,68.42 53.34,69.85 52.07,71.12 53.34,72.39 v54.61,72.39 | 52.62,65.48 55.87,62.23 v58.42,62.23
IN+
  Top 0.508: F2.1A 52.32,2.54 11.43,2.54 6.35,7.62 6.35,29.21 7.62,30.48 D4.C
MISO  (via drill 0.35)
  Top 0.305: AVRISP.1 44.45,72.39 44.45,69.85 40.64,66.04 v40.64,64.77 | v29.21,55.88 v29.21,60.96
  Bottom 0.305: v40.64,64.77 38.58,62.71 37.61,62.71 36.15,61.24 36.15,61.17 35.93,60.96 v29.21,60.96 | U1.18 29.21,52.07 v29.21,55.88
MODE  (via drill 0.35)
  Top 0.305: U1.23 27.94,62.23 26.67,60.96 26.67,59.04 27.75,57.96 28.13,57.96 28.21,58.04 v28.53,58.04 | v29.89,58.97 30.61,58.25 30.61,56.68 31.28,56.01 32.22,56.01 32.89,56.68 32.89,57.02 34.29,58.42 v34.29,59.69 | v36.83,60.96 36.87,60.92 36.87,55.61 36.03,54.78 34.46,54.78 v34.29,54.61
  Bottom 0.305: v28.53,58.04 29.45,58.97 v29.89,58.97 | MODEBUTTON.4 48.26,50.24 46.4,52.1 46.4,54.89 46,55.29 42.59,55.29 40.64,53.34 40.64,52.6 40.64,52.07 39.37,50.8 36.83,50.8 35.56,52.07 35.56,53.34 v34.29,54.61 | v36.83,60.96 35.56,59.69 v34.29,59.69
MOSI  (via drill 0.35)
  Top 0.305: AVRISP.4 52.07,69.85 v52.07,63.5 | v41.91,44.45 44.45,41.91 52.07,41.91 54.61,44.45 v54.61,48.26
  Bottom 0.305: v54.61,48.26 55.88,49.53 55.88,54.61 52.07,58.42 52.07,58.72 52.75,59.41 52.75,61.24 52.07,61.93 v52.07,63.5 | U1.17 33.02,48.26 40.64,48.26 40.64,45.74 41.55,44.83 41.55,44.81 v41.91,44.45
N$1
  Top 0.305: T2.2 34.92,29.21 34.29,29.21 29.21,34.29 22.86,34.29 21.59,35.56 21.59,40.64 20.32,41.91 R14.2
N$2
  Top 0.305: U1.10 25.4,52.07 26.67,50.8 26.67,45.72 25.53,44.58 Q1.1 25.53,35.69 26.67,36.83 33.02,36.83 34.29,35.56 34.29,34.02 33.61,33.34 33.61,32.74 34.24,32.1 34.24,31.8 C8.2
N$3  (via drill 0.35)
  Top 0.305: U1.9 29.21,49.53 29.21,40.64 30.48,39.37 v35.56,39.37
  Bottom 0.305: v35.56,39.37 35.56,34.77 35.13,34.34 34.64,34.34 33.61,33.3 33.61,32.82 33.25,32.46 30.89,32.46 29.49,31.07 28.53,31.07 C7.2 27.94,34.29 29.21,35.56 Q1.2
N$5  (via drill 0.35)
  Top 0.508: v13.97,34.29 17.78,30.48 D4.A
  Bottom 0.508: X1.1 12.8,16.9 14.91,19.01 14.91,20.05 13.97,20.99 v13.97,34.29
N$7  (via drill 0.35)
  Top 0.305: v16.51,58.42 v16.51,54.61 | v26.67,44.45 27.94,45.72 v27.94,48.26 | v27.94,53.34 v30.48,53.34
  Bottom 0.305: R4.1 14.56,61.64 16.79,61.64 17.19,61.24 17.19,60.68 16.51,59.99 v16.51,58.42 | v16.51,54.61 16.51,52.07 18.09,50.49 19.45,50.49 20.02,49.93 20.02,49.49 23.91,45.59 24.6,45.59 25.75,44.45 v26.67,44.45 | v27.94,48.26 v27.94,53.34 | RGLED.1 34.83,57.69 32.89,55.75 31.28,55.75 30.61,55.08 30.61,53.47 v30.48,53.34
N$8  (via drill 0.35)
  Top 0.305: R6.1 14.56,67.9 15.52,67.9 16.51,68.88 16.51,74.93 17.78,76.2 20.32,76.2 22.99,73.53 24.6,73.53 26.67,71.47 v26.67,67.31 | v29.21,64.77 30.48,63.5 v34.29,63.5 | v38.1,63.5 RGLED.3
  Bottom 0.305: v26.67,67.31 27.59,67.31 31.28,70.99 32.22,70.99 32.89,70.32 32.89,69.38 32.22,68.71 31.53,68.71 29.21,66.39 v29.21,64.77 | v34.29,63.5 v38.1,63.5
N$9  (via drill 0.35)
  Top 0.305: v55.88,26.67 55.88,39.37 v54.61,40.64
  Bottom 0.305: R5.1 7.62,66.04 7.62,76.2 12.7,76.2 15.24,78.74 60.96,78.74 64.54,75.16 64.54,31.52 62.23,29.21 57.15,29.21 55.88,27.94 v55.88,26.67 | v54.61,40.64 51.51,43.74 MODEBUTTON.3
N$13  (via drill 0.35)
  Top 0.305: v21.59,20.32 21.59,15.24 v25.4,11.43 | v29.21,13.97 31.75,11.43 31.75,10.16 BUZZER.- | v43.18,24.13 v43.18,12.7
  Bottom 0.305: v25.4,11.43 26.67,11.43 v29.21,13.97 | D1.A 21.59,35.56 v21.59,20.32 | T1.1 41.91,27.94 43.18,26.67 v43.18,24.13 | v43.18,12.7 40.64,12.7 BUZZER.-
N$14  (via drill 0.35)
  Top 0.305: v48.03,40.64 48.85,41.45 52.26,41.45 56.56,45.76 56.56,68.2 55.2,69.57 55.2,70.13 55.88,70.82 55.88,76.2 50.8,81.28 13.88,81.28 6.47,73.88 v6.47,54.61
  Bottom 0.305: T1.2 43.77,34.24 43.77,38.82 45.57,40.62 48.02,40.62 v48.03,40.64 | v6.47,54.61 7.53,54.61 8.49,55.58 9.29,55.58 9.57,55.29 16.79,55.29 17.48,54.61 R9.2
R  (via drill 0.35)
  Top 0.305: U1.24 30.18,64.77 29.49,65.45 28.93,65.45 28.53,65.05 28.53,64.09 25.53,61.09 23.66,61.09 22.99,61.76 22.99,62.1 v20.32,64.77
  Bottom 0.305: v20.32,64.77 20.32,67.31 R4.2
RS  (via drill 0.35)
  Top 0.305: v41.91,77.47 39.17,74.73 37.66,74.73 36.59,73.66 v35.56,73.66 | v25.5,69.85 25.27,69.62 25.27,69.38 24.13,68.23 U1.4 | LCD.4 v62.23,48.26 | v63.5,74.93 60.96,77.47 60.96,78.74 58.42,81.28 55.88,81.28 55.75,81.15 v54.61,81.15 | v52.07,77.47 v49.53,80.01
  Bottom 0.305: v41.91,77.47 42.21,77.47 42.9,78.15 43.46,78.15 44.15,77.47 v49.53,77.47 v52.07,77.47 | v35.56,73.66 34.29,74.93 33.02,73.66 31.13,73.66 28.13,70.66 26.31,70.66 v25.5,69.85 | v62.23,48.26 62.23,52.07 63.5,53.34 v63.5,74.93 | v49.53,80.01 50.67,81.15 v54.61,81.15
RST  (via drill 0.35)
  Top 0.508: v41.91,52.07 41.91,66.04 45.72,69.85 AVRISP.5 | R1.1 11.43,77.47 21.59,77.47 U1.1 | v41.91,39.37 43.18,38.1 v43.18,30.48
  Bottom 0.508: U1.1 26.67,77.47 39.37,77.47 AVRISP.5 | v41.91,39.37 43.18,40.64 43.18,46.99 41.91,48.26 41.91,48.98 42.14,49.2 42.14,49.85 41.91,50.08 v41.91,52.07 | v43.18,30.48 45.3,30.48 47.17,28.61 47.17,24.47 46.01,23.31 RESET.1
RX  (via drill 0.35)
  Top 0.305: v15.24,60.96 R8.2 19.05,55.98 18.09,55.01 18.09,54.21 19.26,53.03 19.45,53.03 20.02,52.47 20.02,51.1 v20.32,50.8 | v30.48,40.64 33.02,40.64 34.29,41.91 34.29,42.22 33.98,42.53 33.98,44.75 33.76,44.97 33.76,46.47 33.98,46.69 33.98,48.91 34.29,49.22 v34.29,50.8 | v39.37,55.88 39.37,62.23 v40.64,63.5 | v41.91,68.58 v43.18,69.85 | v45.72,67.31 46.99,66.04 43.77,62.82 43.77,61.95 43.86,61.85 43.86,58.8 43.77,58.7 43.77,54.33 44.17,53.93 46.55,53.93 48.5,55.88 ESP8266.1
  Bottom 0.305: v15.24,60.96 10.16,60.96 R7.1 | v20.32,50.8 22.99,48.13 24.6,48.13 27.35,45.38 27.35,43.77 v30.48,40.64 | v34.29,50.8 34.29,53.34 34.6,53.65 34.33,53.93 34.01,53.93 33.61,54.33 33.61,54.89 34.01,55.29 34.57,55.29 34.97,54.89 34.97,54.57 35.25,54.3 36.83,55.88 v39.37,55.88 | v40.64,63.5 41.91,64.77 v41.91,68.58 | v43.18,69.85 v45.72,67.31
RXM  (via drill 0.35)
  Top 0.305: v25.5,67.31 25.5,68.88 26.18,69.57 26.18,70.34 U1.2 | v20.8,67.79 20.02,67 20.02,66.91 19.45,66.34 19.26,66.34 18.37,65.45 v17.1,65.45 | v15.24,53.34 15.24,59.99 14.56,60.68 14.56,62.61 15.24,63.29 v15.24,64.77 | v20.3,48.24 20.3,45.7 R13.2
  Bottom 0.305: v20.8,67.79 21.29,67.31 22.51,67.31 23.66,66.17 24.6,66.17 25.27,66.84 25.27,67.08 v25.5,67.31 | v15.24,53.34 16.05,52.53 16.05,51.16 18.65,48.56 19.97,48.56 v20.3,48.24 | v15.24,64.77 16.41,64.77 v17.1,65.45
RXM1  (via drill 0.35)
  Top 0.305: v45.72,68.58 45.72,68.28 45.04,67.59 45.04,65.36 v43.18,63.5 | v34.29,72.39 34.29,72.09 34.97,71.4 34.97,70.84 34.88,70.74 34.88,69.57 35.28,69.17 37.18,69.17 37.66,69.65 38.54,69.65 39.17,69.02 39.17,68.14 38.54,67.51 37.03,67.51 v34.29,64.77 | v34.29,62.23 32.89,60.83 32.89,59.22 32.22,58.55 31.28,58.55 29.89,59.93 29.89,61.24 29.49,61.64 28.93,61.64 28.53,61.24 28.53,59.01 27.94,58.42 v27.94,58.74 | v27.94,58.74 | v33.12,44.45 32.89,44.68 32.89,47.46 32.22,48.13 31.53,48.13 27.26,52.41 27.26,54.23 27.35,54.33 27.35,54.89 25.5,56.75 v25.5,57.15 | v16.51,34.29 13.97,36.83 v13.97,44.45 | v45.82,57.15 45.72,57.25 45.72,62.23 ESP8266.8
  Bottom 0.305: v43.18,63.5 43.18,60.66 42.5,59.97 42.5,59.41 44.17,57.74 45.23,57.74 v45.82,57.15 | v45.72,68.58 45.42,68.58 43.46,70.53 42.74,70.53 38.54,74.73 37.66,74.73 35.32,72.39 v34.29,72.39 | v34.29,64.77 34.29,64.47 33.61,63.78 33.61,63.22 34.29,62.53 v34.29,62.23 | v27.94,58.74 26.35,57.15 v25.5,57.15 | v33.12,44.45 33.12,44.05 33.7,43.46 33.7,41.6 32.43,40.33 32.43,37.82 32.03,37.42 22.9,37.42 20.94,39.37 17.78,39.37 16.51,38.1 v16.51,34.29 | v13.97,44.45 R13.1
SCK  (via drill 0.35)
  Top 0.305: v35.56,55.88 35.56,57.63 36.12,58.19 36.12,62.48 38.61,64.97 38.99,64.97 39.17,65.15 39.17,65.84 v40.64,67.31 | v40.64,69.85 40.64,74.93 v43.18,77.47
  Bottom 0.305: v40.64,67.31 v40.64,69.85 | v43.18,77.47 45.72,74.93 45.72,73.66 AVRISP.3 | U1.19 33.48,53.8 33.15,54.14 33.15,55.08 33.82,55.75 34.76,55.75 35.1,55.42 v35.56,55.88
SCL  (via drill 0.35)
  Top 0.305: R3.1 7.62,68.58 7.62,50.8 7.93,50.49 9.29,50.49 10.18,50.58 10.38,50.58 11.43,49.53 v11.43,48.26 | v31.75,38.1 34.29,38.1 TO-39.2 | v38.1,38.1 v40.64,38.1
  Bottom 0.305: U1.28 27.94,71.12 10.16,71.12 R3.1 | v11.43,48.26 15.24,48.26 17.78,45.72 21.59,45.72 21.59,39.37 22.86,38.1 v31.75,38.1 | TO-39.2 36.83,36.45 36.15,37.13 36.15,38.97 36.69,39.51 v38.1,38.1 | RTC(MALE).3 38.75,46.99 41.1,44.64 41.1,41.72 40.64,41.26 v40.64,38.1
SDA  (via drill 0.35)
  Top 0.305: v15.24,68.58 11.43,72.39 R2.1 | U1.27 38.1,78.74 49.53,78.74 54.05,74.22 53.34,73.51 53.34,72.39 54.61,71.12 54.61,65.74 53.93,65.05 53.93,64.49 54.15,64.26 54.15,59.5 54.61,59.04 v54.61,53.34 | v51.99,53.42 46.44,53.42 RTC(MALE).2
  Bottom 0.305: U1.27 27.94,68.58 v15.24,68.58 | TO-39.4 39.37,40.64 40.64,41.91 40.64,43.18 39.37,44.45 RTC(MALE).2 | v51.99,53.42 54.53,53.42 v54.61,53.34
TONEGEN  (via drill 0.35)
  Top 0.305: R9.1 10.16,55.88 10.16,58.42 v11.43,59.69 | v16.51,60.96 20.32,60.96 v21.59,59.69
  Bottom 0.305: v21.59,59.69 22.99,61.09 22.99,62.7 23.66,63.37 25.27,63.37 U1.26 | v16.51,60.96 15.24,59.69 v11.43,59.69
TRIG  (via drill 0.35)
  Top 0.305: ULTRASONIC.2 29.21,68.58 26.67,66.04 v21.59,66.04 | v20.32,58.42 v20.32,53.34
  Bottom 0.305: v21.59,66.04 21.59,62.23 20.32,60.96 v20.32,58.42 | v20.32,53.34 22.99,50.67 24.6,50.67 25.27,50 25.27,48.39 U1.15
TXM  (via drill 0.35)
  Top 0.305: v11.43,62.23 11.43,60.66 12.11,59.97 12.11,57.74 v12.7,57.15 | v6.47,74.93 v11.42,79.88 v11.43,79.88 | v27.94,69.85 27.26,70.53 27.26,74.55 28.62,75.92 28.62,76.48 25.23,79.88 v13.97,79.88
  Bottom 0.305: R7.2 16.51,57.15 v12.7,57.15 | v11.43,62.23 9.86,63.8 8.49,63.8 6.47,65.82 v6.47,74.93 | v11.43,79.88 v13.97,79.88 | v27.94,69.85 26.47,69.85 25.78,69.17 25.22,69.17 24.53,69.85 U1.3
VCC
  Top 0.508: 5VREG.1 23.32,6.35 25.4,6.35 | 25.4,6.35 26.67,7.62 CONT.A 22.86,17.78 C11.1 C9.1 D3.A 12.7,33.02 12.7,39.37 | BUZZER.+ 41.91,6.35 25.4,6.35 | BUZZER.+ 58.09,10.16 58.09,10.31 64.06,16.28 64.06,24.36 60.96,27.46 60.96,39.37 LCD.2 | U1.20 29.21,54.61 U1.7 R5.2 22.86,68.58 22.86,72.39 20.32,74.93 R1.2 | U1.20 35.56,58.42 35.56,63.5 ULTRASONIC.1 43.18,71.12 43.18,74.93 45.72,77.47 46.99,77.47 AVRISP.2 | R12.1 10.16,46.99 12.7,44.45 12.7,39.37 | 12.7,39.37 11.43,38.1 D1.C | U1.20 34.29,52.07 35.56,52.07 35.56,49.05 35,48.49 35,46.27 34.77,46.05 34.77,45.4 35,45.17 35,42.95 35.56,42.39 35.56,41.91 36.36,41.11 36.36,39.84 36.83,39.37 40.64,39.37 41.91,38.1 41.91,35.56 TO-39.3 41.91,30.48 41.91,13.97 42.39,13.48 42.39,12.38 42.85,11.91 43.96,11.91 BUZZER.+

### Text on the board
tPlace: AUGUST 6, 2020 | COVID - 19 TEMPERATURE PROJECT